# EAGLE schematic SMARTBALL_v1.2 (EAGLE 9.0.0)
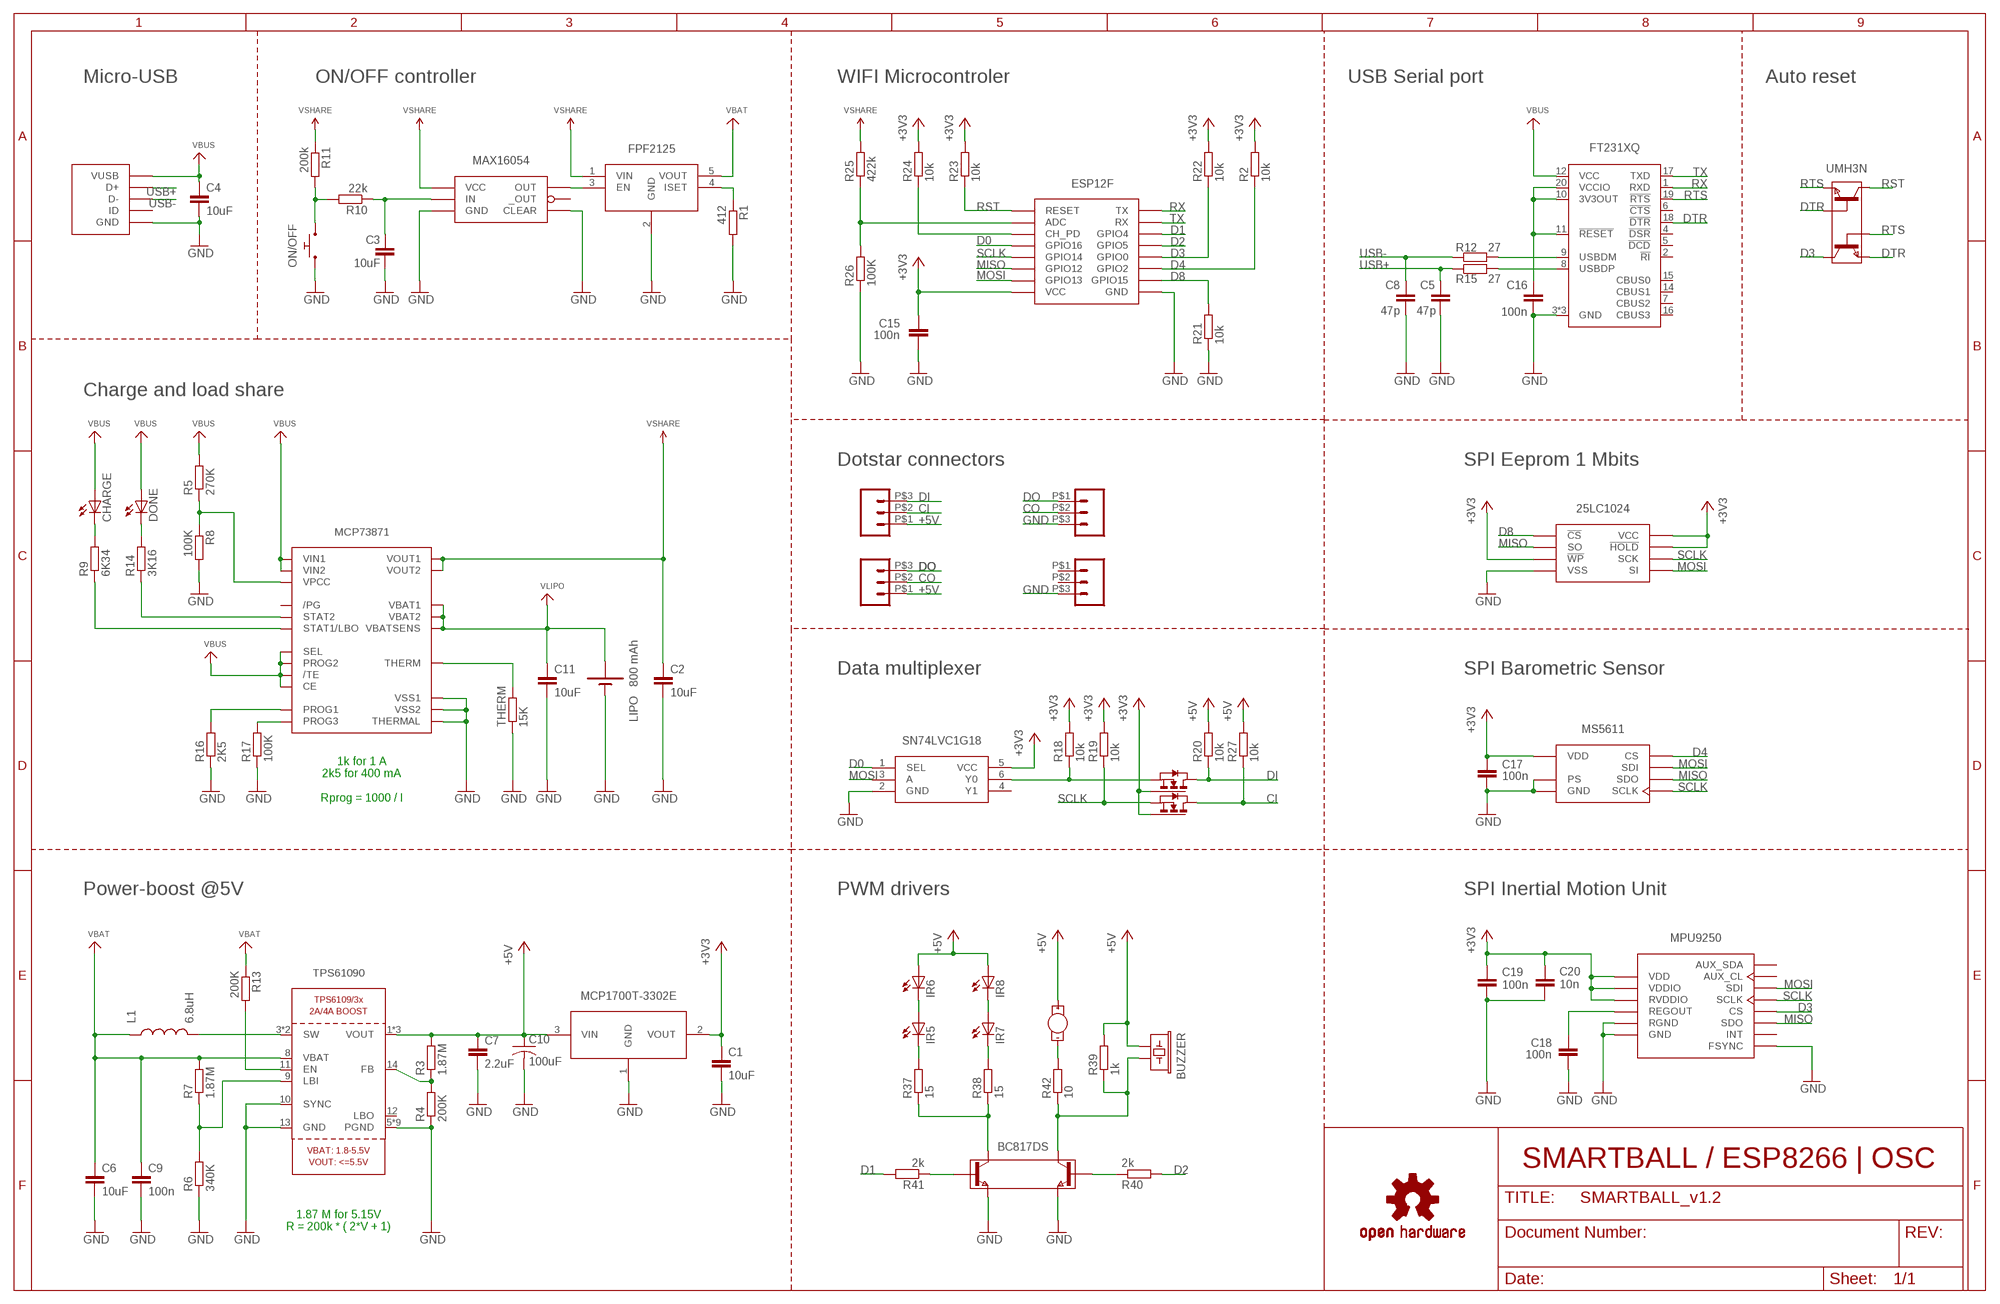
[diagram p0: schematic, sheet 1]

## Parts
BC817DS  BC817DS  [SOT457R_PHILIPS]
BUZZER  BUZZER_PKMCS0909E4000-R1  [BUZZER_PKMCS0909E4000-R1]
C1  10uF  C-EUC0603K  [C0603K]
C2  10uF  C-EUC0603K  [C0603K]
C3  10uF  C-EUC0603K  [C0603K]
C4  10uF  C-EUC0603K  [C0603K]
C5  47p  C-EUC0603K  [C0603K]
C6  10uF  C-EUC0603K  [C0603K]
C7  2.2uF  C-EUC0603K  [C0603K]
C8  47p  C-EUC0603K  [C0603K]
C9  100n  C-EUC0603K  [C0603K]
C10  100uF  C-USC1210  [C1210]
C11  10uF  C-EUC0603K  [C0603K]
C15  100n  C-EUC0603K  [C0603K]
C16  100n  C-EUC0603K  [C0603K]
C17  100n  C-EUC0603K  [C0603K]
C18  100n  C-EUC0603K  [C0603K]
C19  100n  C-EUC0603K  [C0603K]
C20  10n  C-EUC0603K  [C0603K]
CHARGE  KINGBRIGHT_16X08  [KINGBRIGHT_16X08]
DONE  KINGBRIGHT_16X08  [KINGBRIGHT_16X08]
ESP12F  ESP12  [ESP12]
FT231XQ  FT231X  [QFN20]
IR5  LED-SFH4050  [SFH4050]
IR6  LED-SFH4050  [SFH4050]
IR7  LED-SFH4050  [SFH4050]
IR8  LED-SFH4050  [SFH4050]
L1  6.8uH  ASPIAIG-S4035  [ASPIAIG-S4035]
LIPO  BATTERY_CONNECTOR  [MOTOR_CONNECTOR]
LOGO1  OSHW-LOGOL  [OSHW-LOGO-L]
MCP73871  MCP73871  [QFN20_4MM]
MOTOR  MOTOR_CONNECTOR  [MOTOR_CONNECTOR]
ON/OFF  B3U-3000P-B  [B3U-3000P-B]
R1  412  R-EU_R0402  [R0402]
R2  10k  R-EU_R0402  [R0402]
R3  1.87M  R-EU_R0402  [R0402]
R4  200K  R-EU_R0402  [R0402]
R5  270K  R-EU_R0402  [R0402]
R6  340K  R-EU_R0402  [R0402]
R7  1.87M  R-EU_R0402  [R0402]
R8  100K  R-EU_R0402  [R0402]
R9  6K34  R-EU_R0402  [R0402]
R10  22k  R-EU_R0402  [R0402]
R11  200k  R-EU_R0402  [R0402]
R12  27  R-EU_R0402  [R0402]
R13  200K  R-EU_R0402  [R0402]
R14  3K16  R-EU_R0402  [R0402]
R15  27  R-EU_R0402  [R0402]
R16  2K5  R-EU_R0402  [R0402]
R17  100K  R-EU_R0402  [R0402]
R18  10k  R-EU_R0402  [R0402]
R19  10k  R-EU_R0402  [R0402]
R20  10k  R-EU_R0402  [R0402]
R21  10k  R-EU_R0402  [R0402]
R22  10k  R-EU_R0402  [R0402]
R23  10k  R-EU_R0402  [R0402]
R24  10k  R-EU_R0402  [R0402]
R25  422k  R-EU_R0402  [R0402]
R26  100K  R-EU_R0402  [R0402]
R27  10k  R-EU_R0402  [R0402]
R37  15  R-EU_R0402  [R0402]
R38  15  R-EU_R0402  [R0402]
R39  1k  R-EU_R0402  [R0402]
R40  2k  R-EU_R0402  [R0402]
R41  2k  R-EU_R0402  [R0402]
R42  10  R-EU_R0402  [R0402]
THERM  15K  R-EU_R0402  [R0402]
TPS61090  TPS61090RSAR  VREG_TPS6103X  [PVQFN-16]
U$1  MOLEX-USB  [MOLEX-USB]
U$2  FPF2125  [SOT23-5]
U$3  MCP1700T  [SOT23-3]
U$5  CONN_03_SMD  [CONN03_SMD]
U$6  CONN_03_SMD  [CONN03_SMD]
U$12  MAX16054  [TSOT23-6]
U$14  CONN_03_SMD  [CONN03_SMD]
U$15  CONN_03_SMD  [CONN03_SMD]
U$16  25LC1024DFN-S  [DFN-S]
U$17  MS5611  [MS5611-QFN]
U$20  SN74LVC1G18  [DCK_R-PDSO-G6]
U$21  MPU-9250QFN24G  [QFN24G-0.4-3X3MM]
U$22  2N7002PS  [SOT363_PHILIPS]
UMH3N  UMH3N  [SOT363_PHILIPS]

## Nets
+3V3 [+3v3]: C1.1 C15.1 C17.1 C19.1 C20.2 ESP12F.VCC R2.2 R18.2 R19.2 R22.2 R23.2 R24.2 U$3.2(VOUT) U$16.3(!WP) U$16.7(!HOLD) U$16.8(VCC) U$17.P$1(VDD) U$20.5(VCC) U$21.1(RVDDIO) U$21.8(VDDIO) U$21.13(VDD) U$22.2(G1) U$22.5(G2)
+5V [power]: BUZZER.P$1 C7.1 C10.1 IR6.P$1(A) IR8.P$1(A) MOTOR.+ R3.2 R20.2 R27.2 R39.2 TPS61090.1(VOUT) TPS61090.15(VOUT) TPS61090.16(VOUT) U$3.3(VIN) U$5.P$1 U$15.P$1
CI: R27.1 U$5.P$2 U$22.3(D2)
CO: U$6.P$2 U$15.P$2
D0: ESP12F.GPIO16 U$20.1(SEL)
D1: ESP12F.GPIO4 R41.2
D2: ESP12F.GPIO5 R40.2
D3: ESP12F.GPIO0 R22.1 U$21.22(CS) UMH3N.3(C2)
D4: ESP12F.GPIO2 R2.1 U$17.P$4(CS) U$17.P$5(CS)
D8: ESP12F.GPIO15 R21.2 U$16.1(!CS)
DI: R20.1 U$5.P$3 U$22.6(D1)
DO: U$6.P$1 U$15.P$3
DTR: FT231XQ.18(!DTR) UMH3N.2(B1) UMH3N.4(E2)
EN1: ESP12F.CH_PD R24.1
ENABLE: R13.2 TPS61090.11(EN)
GND [power]: BC817DS.1(E1) BC817DS.4(E2) C1.2 C2.2 C3.2 C4.2 C5.2 C6.2 C7.2 C8.2 C9.2 C10.2 C11.2 C15.2 C16.2 C17.2 C18.2 C19.2 C20.1 ESP12F.GND FT231XQ.3(GND) FT231XQ.13(GND) FT231XQ.EXP(GND) LIPO.- MCP73871.P$10(VSS1) MCP73871.P$11(VSS2) MCP73871.P$21(THERMAL) ON/OFF.P$1 R1.2 R4.1 R6.1 R8.2 R16.1 R17.1 R21.1 R26.1 THERM.1 TPS61090.5(PGND) TPS61090.6(PGND) TPS61090.7(PGND) TPS61090.10(SYNC) TPS61090.13(GND) TPS61090.P$18(PGND) TPS61090.P$19(PGND) TPS61090.P$20(PGND) TPS61090.P$21(PGND) TPS61090.P$22(PGND) TPS61090.THERMAL(PGND) U$1.GND U$1.P$1(GND) U$1.P$11(GND) U$1.SHELL1(GND) U$1.SHELL2(GND) U$1.SHELL5(GND) U$1.SHELL6(GND) U$2.2(GND) U$3.1(GND) U$6.P$3 U$12.CLEAR U$12.GND U$14.P$3 U$16.4(VSS) U$17.P$2(PS) U$17.P$3(GND) U$20.2(GND) U$21.11(FSYNC) U$21.18(GND) U$21.20(RGND)
MISO: ESP12F.GPIO12 U$16.2(SO) U$17.P$6(SDO) U$21.9(SDO)
MOSI: ESP12F.GPIO13 U$16.5(SI) U$17.P$7(SDI) U$20.3(A) U$21.24(SDI)
N$1: U$2.3(EN) U$12.OUT
N$2: R1.1 U$2.4(ISET)
N$3: MCP73871.P$2(VPCC) R5.1 R8.1
N$4: MCP73871.P$13(PROG1) R16.2
N$5: FT231XQ.9(USBDM) R12.2
N$6: FT231XQ.8(USBDP) R15.2
N$8: ON/OFF.P$2 R10.2 R11.2
N$9: C3.1 R10.1 U$12.IN
N$11: R18.1 U$20.6(Y0) U$22.1(S1)
N$12: ESP12F.ADC R25.1 R26.2
N$17: L1.P$2 TPS61090.3(SW) TPS61090.4(SW)
N$18: R6.2 R7.1 TPS61090.9(LBI)
N$21: R3.1 R4.2 TPS61090.14(FB)
N$22: MCP73871.P$7(STAT2) R14.1
N$23: MCP73871.P$8(STAT1/LBO) R9.1
N$25: MCP73871.P$5(THERM) THERM.2
N$26: DONE.CATHODE(C) R14.2
N$27: CHARGE.CATHODE(C) R9.2
N$28: MCP73871.P$12(PROG3) R17.2
N$55: IR5.P$2(C) R37.2
N$56: IR5.P$1(A) IR6.P$2(C)
N$57: BC817DS.3(C2) R37.1 R38.1
N$58: IR7.P$2(C) R38.2
N$59: IR7.P$1(A) IR8.P$2(C)
N$60: BC817DS.6(C1) BUZZER.P$2 R39.1 R42.1
N$61: MOTOR.- R42.2
N$62: BC817DS.5(B2) R41.1
N$63: BC817DS.2(B1) R40.1
REGOUT1: C18.1 U$21.10(REGOUT)
RST: ESP12F.RESET R23.1 UMH3N.6(C1)
RTS: FT231XQ.19(!RTS) UMH3N.1(E1) UMH3N.5(B2)
RX: ESP12F.TX FT231XQ.1(RXD)
SCLK: ESP12F.GPIO14 R19.1 U$16.6(SCK) U$17.P$8(SCLK) U$21.23(SCLK) U$22.4(S2)
TX: ESP12F.RX FT231XQ.17(TXD)
USB+: C5.1 R15.1 U$1.D+
USB-: C8.1 R12.1 U$1.D-
VBAT [power]: C6.1 C9.1 L1.P$1 R7.2 R13.1 TPS61090.8(VBAT) U$2.5(VOUT)
VBUS [power]: C4.1 CHARGE.ANODE(A) DONE.ANODE(A) FT231XQ.12(VCC) MCP73871.P$3(SEL) MCP73871.P$4(PROG2) MCP73871.P$9(/TE) MCP73871.P$17(CE) MCP73871.P$18(VIN1) MCP73871.P$19(VIN2) R5.2 U$1.VUSB
VCCIO1: C16.1 FT231XQ.10(3V3OUT) FT231XQ.11(!RESET) FT231XQ.20(VCCIO)
VLIPO: C11.1 LIPO.+ MCP73871.P$14(VBAT1) MCP73871.P$15(VBAT2) MCP73871.P$16(VBATSENS)
VSHARE [power]: C2.1 MCP73871.P$1(VOUT1) MCP73871.P$20(VOUT2) R11.1 R25.2 U$2.1(VIN) U$12.VCC
Unconnected: FT231XQ.2(!RI) FT231XQ.4(!DSR) FT231XQ.5(!DCD) FT231XQ.6(!CTS) FT231XQ.7(CBUS2) FT231XQ.14(CBUS1) FT231XQ.15(CBUS0) FT231XQ.16(CBUS3) MCP73871.P$6(/PG) TPS61090.12(LBO) U$1.ID U$12._OUT U$14.P$1 U$14.P$2 U$20.4(Y1) U$21.7(AUX_CL) U$21.12(INT) U$21.21(AUX_SDA)

## Notes on the sheet
- Micro-USB | ON/OFF controller | WIFI Microcontroler | USB Serial port | Auto reset
- FPF2125
- MAX16054
- Charge and load share
- Dotstar connectors | SPI Eeprom 1 Mbits
- Data multiplexer | SPI Barometric Sensor
- 800 mAh
- SN74LVC1G18
- 1k for 1 A
  2k5 for 400 mA
  
  Rprog = 1000 / I
- Power-boost @5V | PWM drivers | SPI Inertial Motion Unit
- MCP1700T-3302E
- SMARTBALL / ESP8266 | OSC
- 1.87 M for 5.15V
  R = 200k * ( 2*V + 1)

## Library data of the parts
BC817DS = Smartball:BC817DS
BUZZER = Smartball:BUZZER_PKMCS0909E4000-R1
C1-C9 C11 C15-C20 = rcl:C-EU: CAPACITOR, European symbol; SPICEPREFIX: C
C10 = rcl:C-US: CAPACITOR, American symbol
CHARGE DONE = Smartball:KINGBRIGHT_16X08
ESP12F = esp8266modules:ESP12: ESP8266 Wifi module 12
FT231XQ = Smartball:FT231X
IR5-IR8 = Smartball:LED-SFH4050: 850 nm High Power IR Led from OSRAM
L1 = Smartball:ASPIAIG-S4035
LIPO = Smartball:BATTERY_CONNECTOR
LOGO1 = SparkFun-Aesthetics:OSHW-LOGO: Open-Source Hardware (OSHW) Logo This logo indicates the piece of hardware it is found on incorporates a OSHW license and/or adheres to the definition of open source hardware found here: http://freedomdefined.org/OSHW
MCP73871 = microbuilder:MCP73871: MCP73871 Lithium Polymer Battery Charger Digikey: MCP73871-2CCI/ML-ND
MOTOR = Smartball:MOTOR_CONNECTOR
ON/OFF = Smartball:B3U-3000P-B
R1-R27 R37-R42 THERM = rcl:R-EU_: RESISTOR, European symbol; SPICEPREFIX: R
TPS61090 = microbuilder:VREG_TPS6103X: TPS6103x 4A Boost - 1.8-5.5V Input, Adjustable Output to 5.5V
U$1 = Smartball:MOLEX-USB
U$2 = Smartball:FPF2125
U$3 = Smartball:MCP1700T
U$5 U$6 U$14 U$15 = Smartball:CONN_03_SMD
U$12 = Smartball:MAX16054
U$16 = Smartball:25LC1024: Microship 25LC1024 1Mbit SPI EEPROM
U$17 = Smartball:MS5611: MS5611 barometric sensor
U$20 = Smartball:SN74LVC1G18
U$21 = Smartball:MPU-9250: MPU-9250 Invensense IMU Chipset
U$22 = Smartball:2N7002PS
UMH3N = Smartball:UMH3N

## Net classes
0 default: width 0.152 mm
1 power: width 0.254 mm
2 +3v3: width 0.203 mm